# Altium schematic sheet ControleLeds.SchDoc: CONTROLADORA MAIS PIPOCA - REVISÃO EMC
size A3; DocumentNumber: GA0078; SheetNumber: 7; SheetTotal: 17
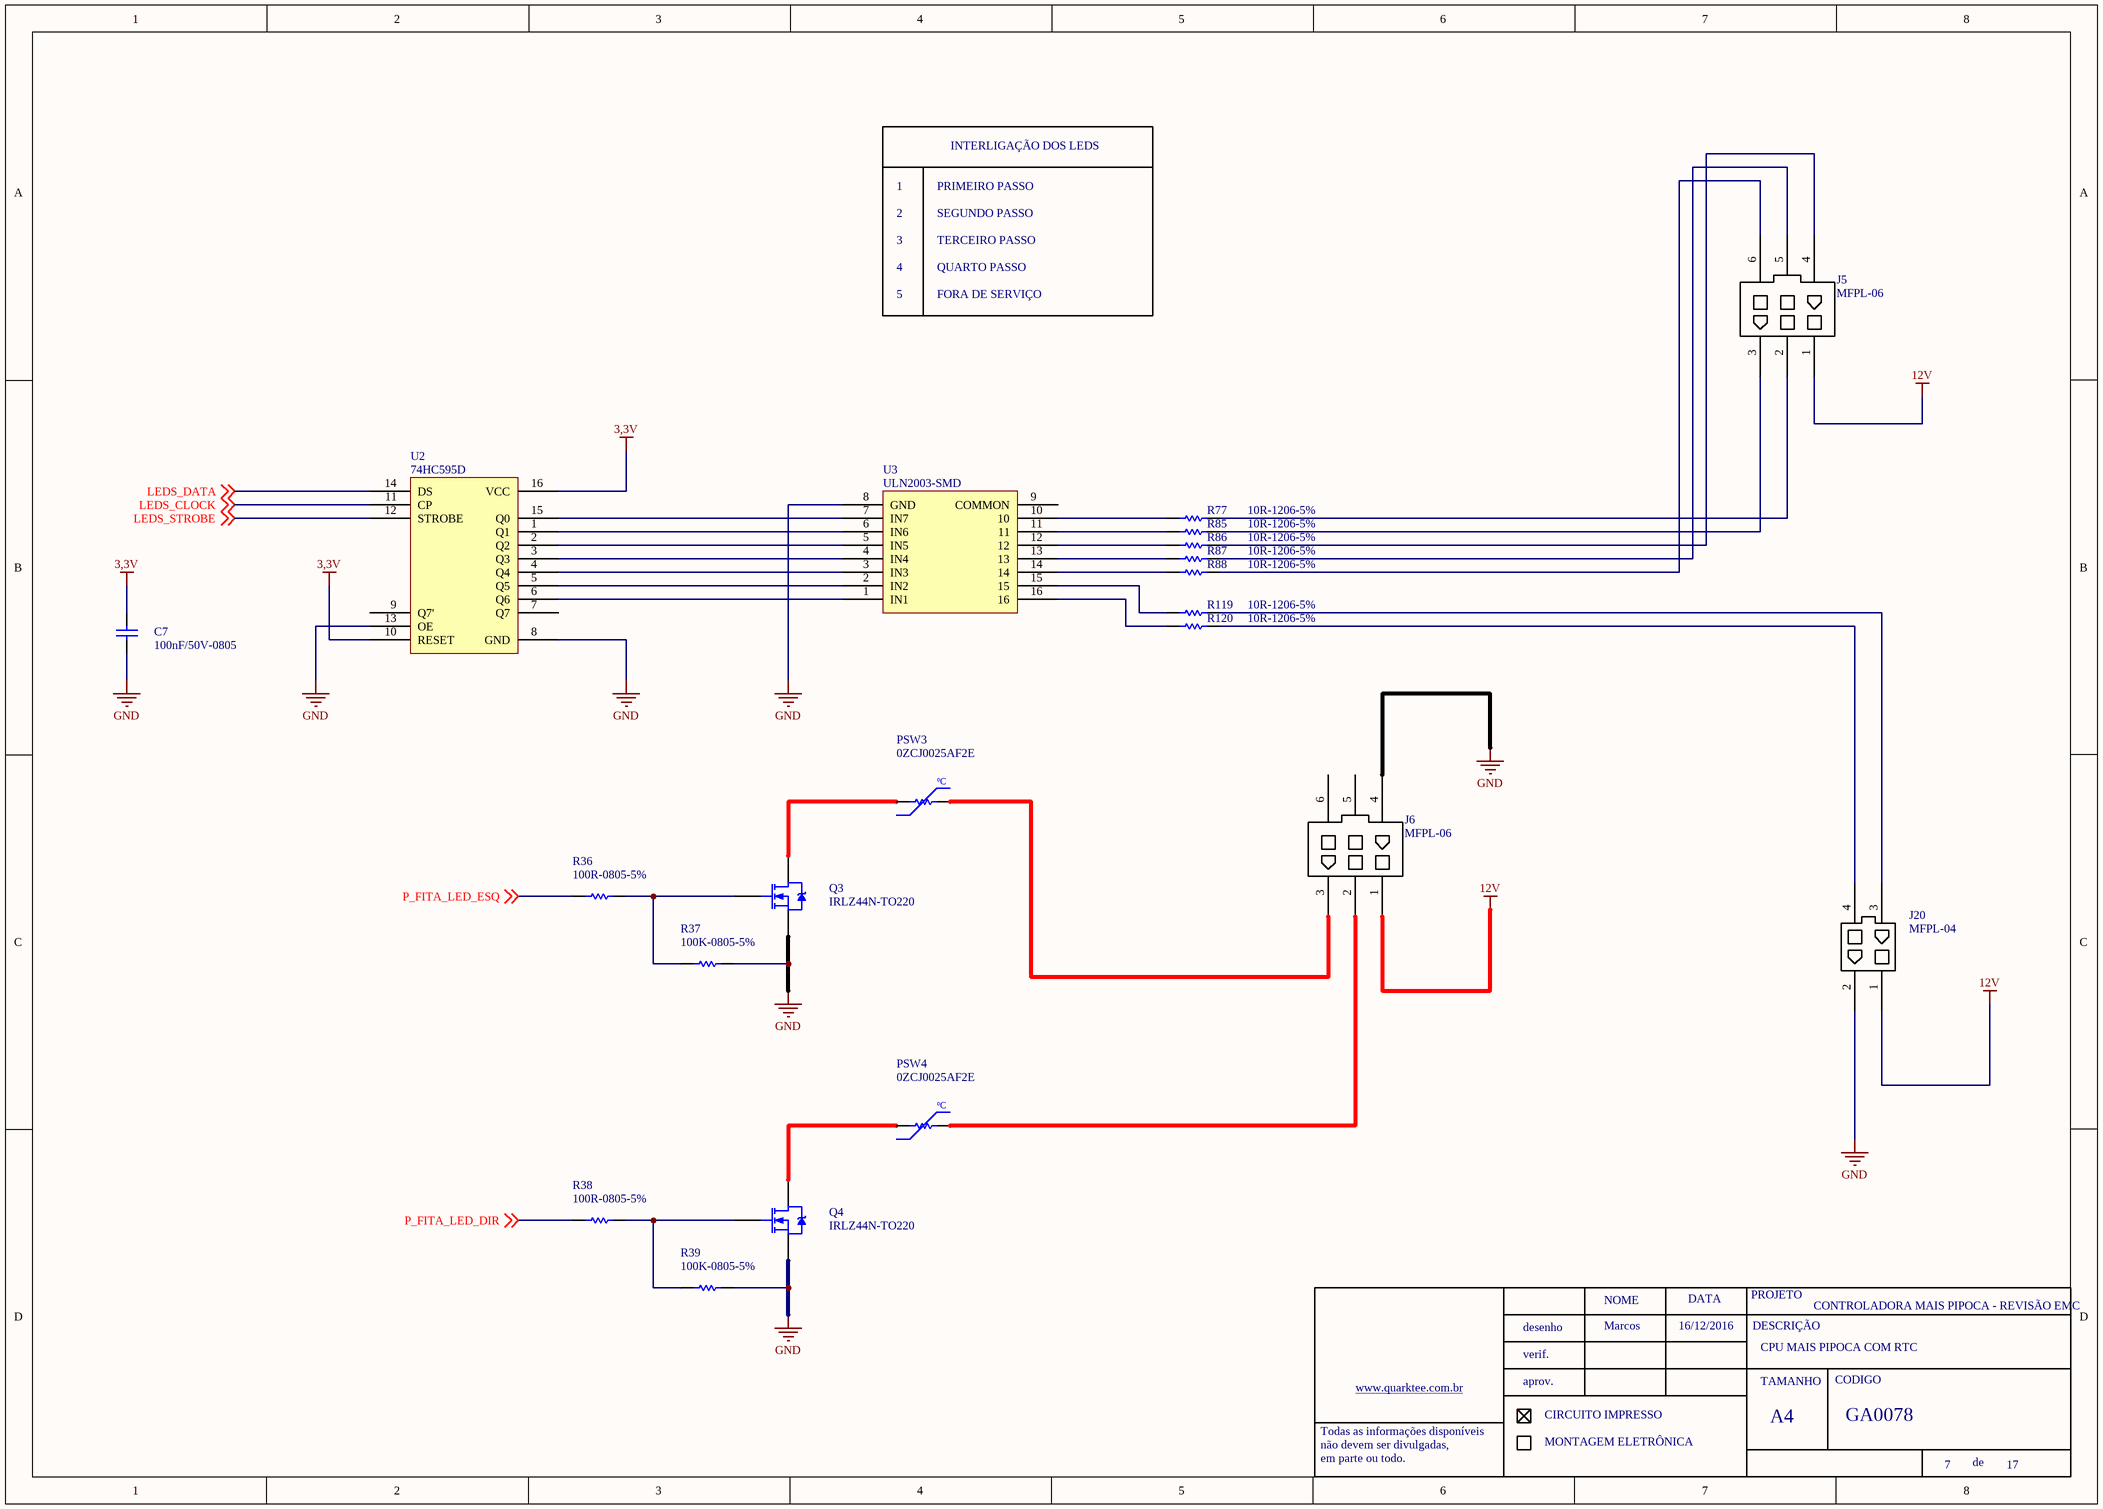
[diagram p0: ControleLeds.SchDoc]

## Parts
C7  100nF/50V-0805  [0805-REVISADO ONDA]
J5  MFPL-06
J6  MFPL-06
J20  MFPL-04
PSW3  0ZCJ0025AF2E  [1206-REVISADO ONDA]
PSW4  0ZCJ0025AF2E  [1206-REVISADO ONDA]
Q3  IRLZ44N-TO220  [TO220-3 EM PÉ]
Q4  IRLZ44N-TO220  [TO220-3 EM PÉ]
R36  100R-0805-5%  [0805-REVISADO ONDA]
R37  100K-0805-5%  [0805-REVISADO ONDA]
R38  100R-0805-5%  [0805-REVISADO ONDA]
R39  100K-0805-5%  [0805-REVISADO ONDA]
R77  10R-1206-5%  [1206-REVISADO ONDA]
R85  10R-1206-5%  [1206-REVISADO ONDA]
R86  10R-1206-5%  [1206-REVISADO ONDA]
R87  10R-1206-5%  [1206-REVISADO ONDA]
R88  10R-1206-5%  [1206-REVISADO ONDA]
R119  10R-1206-5%  [1206-REVISADO ONDA]
R120  10R-1206-5%  [1206-REVISADO ONDA]
U2  74HC595D  [SOIC 16 PINOS]
U3  ULN2003-SMD  [SOIC 16 PINOS]

## Nets
3,3V: C7.2 U2.10(RESET) U2.16(VCC)
12V: J5.1 J6.1 J20.1
GND: C7.1 J6.4 J20.2 Q3.3(S) Q4.3(S) R37.2 R39.2 U2.8(GND) U2.13(OE) U3.8(GND)
LEDS_CLOCK: U2.11(CP) ; off-sheet LEDS_CLOCK
LEDS_DATA: U2.14(DS) ; off-sheet LEDS_DATA
LEDS_STROBE: U2.12(STROBE) ; off-sheet LEDS_STROBE
P_FITA_LED_DIR: R38.1 ; off-sheet P_FITA_LED_DIR
P_FITA_LED_ESQ: R36.1 ; off-sheet P_FITA_LED_ESQ
NetJ5_2: J5.2 R77.2
NetJ5_3: J5.3 R85.2
NetJ5_4: J5.4 R86.2
NetJ5_5: J5.5 R87.2
NetJ5_6: J5.6 R88.2
NetJ6_2: J6.2 PSW4.2
NetJ6_3: J6.3 PSW3.2
NetJ20_3: J20.3 R119.2
NetJ20_4: J20.4 R120.2
NetPSW3_1: PSW3.1 Q3.2(D)
NetPSW4_1: PSW4.1 Q4.2(D)
NetQ3_1: Q3.1(G) R36.2 R37.1
NetQ4_1: Q4.1(G) R38.2 R39.1
NetR77_1: R77.1 U3.10
NetR85_1: R85.1 U3.11
NetR86_1: R86.1 U3.12
NetR87_1: R87.1 U3.13
NetR88_1: R88.1 U3.14
NetR119_1: R119.1 U3.15
NetR120_1: R120.1 U3.16
NetU2_1: U2.1(Q1) U3.6(IN6)
NetU2_2: U2.2(Q2) U3.5(IN5)
NetU2_3: U2.3(Q3) U3.4(IN4)
NetU2_4: U2.4(Q4) U3.3(IN3)
NetU2_5: U2.5(Q5) U3.2(IN2)
NetU2_6: U2.6(Q6) U3.1(IN1)
NetU2_15: U2.15(Q0) U3.7(IN7)

Not connected (* = marked no-connect by the designer): J6 5 6; U2 7(Q7) 9(Q7'); U3 9(COMMON)

## Notes on the sheet
- INTERLIGAÇÃO DOS LEDS
- 1
- 2
- 3
- PRIMEIRO PASSO
- SEGUNDO PASSO
- TERCEIRO PASSO
- 4
- 5
- QUARTO PASSO
- FORA DE SERVIÇO
- Marcos
- 16/12/2016
- CPU MAIS PIPOCA COM RTC
- NOME
- DATA
- PROJETO
- DESCRIÇÃO
- www.quarktee.com.br
- desenho
- verif.
- aprov.
- TAMANHO
- CODIGO
- Todas as informações disponíveis
- não devem ser divulgadas,
- em parte ou todo.
- CIRCUITO IMPRESSO
- MONTAGEM ELETRÔNICA
- A4
- de
- (in symbol PTC 2A-120V) ºC

## Library data of the parts
C7 = 100nF/50-0805-NPO: ERP: 104.11.005
PSW3 PSW4 = PTC 2A-120V
R77 R85-R88 R119 R120 = 10R-0805-5%
U2 = 74HC595D: ERP: CADASTRAR
U3 = ULN2003
Q3 Q4 = IRLZ44N-TO220: ERP: 107.01.006
R36 R38 = 100R-0805-5%: ERP: 102.11.031
R37 R39 = 100K-0805-5%: ERP: 102.11.066